# Altium schematic sheet OPID[351] 5V Step-down regulator.SchDoc: 188-2 5V Step-down regulator
size A4; Author: Andreas Tesaker; CompanyName: VORTEX NTNU; Revision: A; SheetNumber: 2
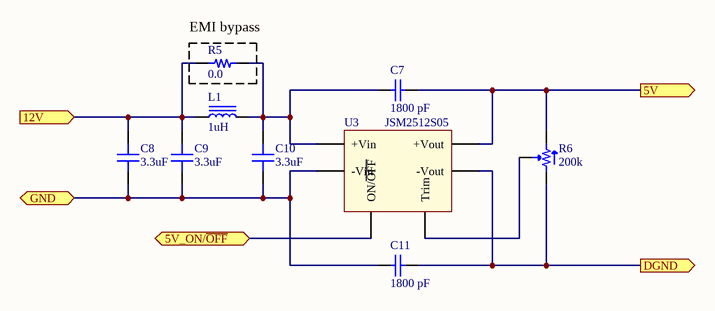
[diagram p0: OPID[351] 5V Step-down regulator.SchDoc]

## Parts
C7  1800 pF  [CAP1210(3225)]
C8  3.3uF  [CAP 1210/3225 - 2.0MM]
C9  3.3uF  [CAP 1210/3225 - 2.0MM]
C10  3.3uF  [CAP 1210/3225 - 2.0MM]
C11  1800 pF  [CAP1210(3225)]
L1  1uH  [TDK VLS252012CX]
R5  0.0  [RES 0805/2012]
R6  200k  [POT PANASONIC EVM2W]
U3  JSM2512S05  [JSM2512S05]

## Ports
5V (out), 5V_ON/~{OFF}, 12V (in), DGND (out), GND

## Nets
5V: C7.2 R6.3 U3.3(+Vout) ; port 5V
5V_ON/~{OFF}: U3.6(ON/~{OFF}) ; port 5V_ON/~{OFF}
12V: C8.2 C9.2 L1.1 R5.1 ; port 12V
DGND: C11.2 R6.1 U3.5(-Vout) ; port DGND
GND: C8.1 C9.1 C10.1 C11.1 U3.2(-Vin) ; port GND
NetC7_1: C7.1 C10.2 L1.2 R5.2 U3.1(+Vin)
NetR6_2: R6.2 U3.4(Trim)

## Notes on the sheet
- (near R5) EMI bypass
- Title
- Size
- Author
- Rev
- A4
- Sheet no.
- of

## Library data of the parts
C7 C11 = C1210C182JGRACTU: Voltage Rating: 2 kV; Tolerance: ± 5%; Part Number: C1210C182JGRACTU; Value: 1800 pF; ComponentLink1Description: Manufacturer Link; ComponentLink1URL: http://www.kemet.com/; ComponentLink2Description: Datasheet; ComponentLink2URL: https://content.kemet.com/datasheets/KEM_C1010_X7R_HV_SMD.pdf; Supplier 1: Digi-Key; Supplier Part Number 1: 399-4821-1-ND
C8-C10 = C1210C335K3NACTU: CAP CER 3.3UF 25V X8L 1210; Manufacturer: Kemet; TemperatureRange: -55C ~ 150C; Tolerance: 10%; Value: 3.3uF; Part Number: C1210C335K3NACTU; PartId: 18606; Supplier 1: Digi-Key; Supplier Part Number 1: 399-5739-2-ND; ComponentLink1Description: Datasheet; ComponentLink1URL: http://www.kemet.com/Lists/ProductCatalog/Attachments/71/KEM_C1008_X8L_150C_SMD.pdf; ComponentLink2Description: Digi-Key Listing; ComponentLink2URL: https://www.digikey.com/product-detail/en/kemet/C1210C335K3NACTU/399-5739-2-ND/2209335; TemperatureCoefficient: X8L; Voltage: 25V; Price: 0,2645; Device Package: 1210 (3225 Metric)
L1 = VLS252012CX-1R0M: FIXED IND 1UH 2.55A 62 MOHM SMD; Manufacturer: TDK Corporation; Type: Wirewound; Tolerance: 20%; Shielding: Shielded; DC Resistance (DCR): 62 mOhm Max; Value: 1uH; Part Number: VLS252012CX-1R0M; PartId: 9505; Supplier 1: Digi-Key; Supplier Part Number 1: 445-172980-2-ND; ComponentLink1Description: Datasheet; ComponentLink1URL: https://product.tdk.com/info/en/catalog/datasheets/inductor_commercial_power_vls252012cx_en.pdf; ComponentLink2Description: Digi-Key Listing; ComponentLink2URL: https://www.digikey.com/product-detail/en/VLS252012CX-1R0M/445-172980-2-ND/5169785; Price: 0,1785; Device Package: Nonstandard; Series: VLS-CX; Inductance: 1uH; Current Rating: 2.55A; Q @ Freq: -; Frequency - Self Resonant: -; Operating Temperature: -40C ~ 105C
R5 = 5106: RES SMD 0.0 OHM JUMPER 1/2W 0805; Part Number: 5106; Manufacturer: Keystone Electronics; PowerRating: 0.5W, 1/2W; Value: 0.0; PartId: 16148; Supplier 1: Digi-Key; Supplier Part Number 1: 36-5106TR-ND; ComponentLink1Description: Datasheet; ComponentLink1URL: http://www.keyelco.com/product-pdf.cfm?p=14039; ComponentLink2Description: Digi-Key Listing; ComponentLink2URL: https://www.digikey.com/product-detail/en/keystone-electronics/5106/36-5106TR-ND/5118868; Tolerance: Jumper; Price: 0,2505; Device Package: 0805 (2012 Metric)
R6 = EVM-2WSX80B25: TRIMMER 200K OHM 0.15W SMD; Manufacturer: Panasonic Electronic Components; TemperatureCoefficient: 250ppm/C; Tolerance: 25%; Number Of Turns: 1; Adjustment Type: Top Adjustment; Value: 200k; Part Number: EVM-2WSX80B25; PartId: 9788; Supplier 1: Digi-Key; Supplier Part Number 1: P2W204TR-ND; ComponentLink1Description: Datasheet; ComponentLink1URL: http://industrial.panasonic.com/cdbs/www-data/pdf/AOI0000/AOI0000CE1.pdf; ComponentLink2Description: Digi-Key Listing; ComponentLink2URL: https://www.digikey.com/product-detail/en/panasonic-electronic-components/EVM-2WSX80B25/P2W204TR-ND/259730; PowerRating: 0.15W; Price: 0,2394
U3 = JSM2512S05: XP Power J Series JSM25 DC/DC Converter; Vin,min: 9V; Vin,max: 18V; Vout,nom: 5V; Iout,max: 5A; Part Number: JSM2512S05; ComponentLink1Description: Manufacturer Link; ComponentLink1URL: https://www.xppower.com/; ComponentLink2Description: Datasheet; ComponentLink2URL: http://www.xppower.com/Portals/0/pdfs/SF_JSM25.pdf; Supplier 1: Digi-Key; Supplier Part Number 1: 1470-3507-ND